# EAGLE schematic client (EAGLE 9.0.1)
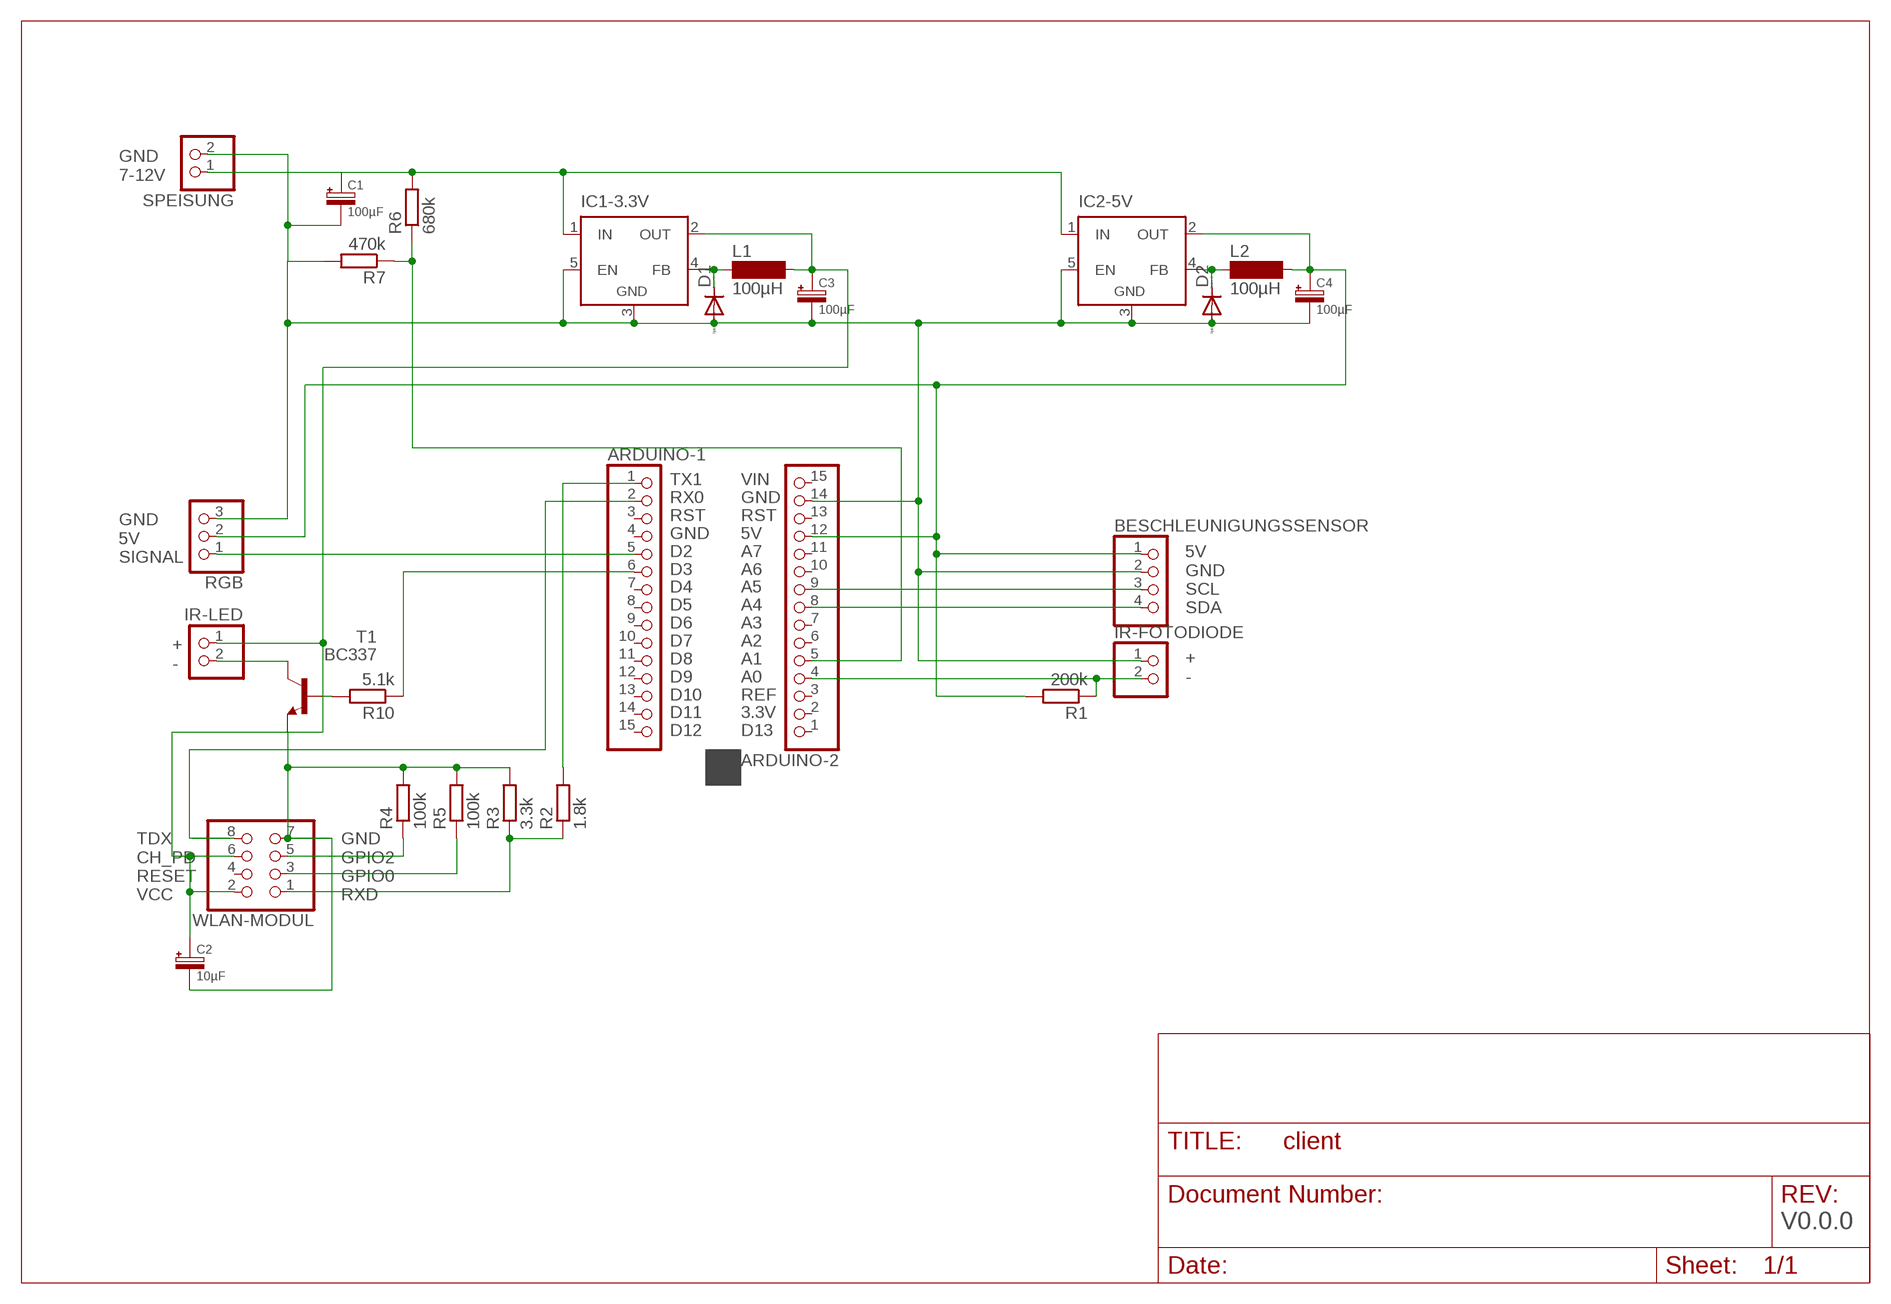
[diagram p0: schematic, sheet 1]

## Parts
ARDUINO-1  PINHD-1X15  [1X15]
ARDUINO-2  PINHD-1X15  [1X15]
BESCHLEUNIGUNGSSENSOR  PINHD-1X4  [1X04]
C1  100µF  KONDENSATOR_ELEKTROLYT  [KONDENSATOR_ELEKTROLYT]
C2  10µF  KONDENSATOR_ELEKTROLYT  [KONDENSATOR_ELEKTROLYT]
C3  100µF  KONDENSATOR_ELEKTROLYT  [KONDENSATOR_ELEKTROLYT]
C4  100µF  KONDENSATOR_ELEKTROLYT  [KONDENSATOR_ELEKTROLYT]
D1  DIODE-D-2.5  [D-2.5]
D2  DIODE-D-2.5  [D-2.5]
IC1-3.3V  LM2596TV  [TO220-51]
IC2-5V  LM2596TV  [TO220-51]
IR-FOTODIODE  PINHD-1X2  [1X02]
IR-LED  PINHD-1X2  [1X02]
L1  100µH  SM-L15A  [SM-L15A]
L2  100µH  SM-L15A  [SM-L15A]
R1  200k  R-EU_0204/2V  [0204V]
R2  1.8k  R-EU_0207/10  [0207/10]
R3  3.3k  R-EU_0207/10  [0207/10]
R4  100k  R-EU_0207/10  [0207/10]
R5  100k  R-EU_0207/10  [0207/10]
R6  680k  R-EU_0204/2V  [0204V]
R7  470k  R-EU_0204/2V  [0204V]
R10  5.1k  R-EU_0204/2V  [0204V]
RGB  PINHD-1X3  [1X03]
SPEISUNG  PINHD-1X2  [1X02]
T1  BC337  [TO92]
WLAN-MODUL  PINHD-2X4  [2X04]

## Nets
N$1: D1.C IC1-3.3V.4(FB) L1.1
N$3: C1.P$2 IC1-3.3V.1(IN) IC2-5V.1(IN) R6.2 SPEISUNG.1
N$4: ARDUINO-2.14 BESCHLEUNIGUNGSSENSOR.2 C1.P$1 C3.P$1 C4.P$1 D1.A D2.A IC1-3.3V.3(GND) IC1-3.3V.5(EN) IC2-5V.3(GND) IC2-5V.5(EN) IR-FOTODIODE.1 R7.2 RGB.3 SPEISUNG.2
N$5: D2.C IC2-5V.4(FB) L2.1
N$7: ARDUINO-2.5 R6.1 R7.1
N$8: C2.P$2 C3.P$2 IC1-3.3V.2(OUT) IR-LED.1 L1.2 WLAN-MODUL.2 WLAN-MODUL.6
N$10: C2.P$1 R3.2 R4.2 R5.2 T1.1(E) WLAN-MODUL.7
N$11: R2.1 R3.1 WLAN-MODUL.1
N$12: R5.1 WLAN-MODUL.3
N$13: R4.1 WLAN-MODUL.5
N$14: ARDUINO-1.1 R2.2
N$15: ARDUINO-1.2 WLAN-MODUL.8
N$16: IR-LED.2 T1.3(C)
N$17: ARDUINO-1.5 RGB.1
N$18: R10.2 T1.2(B)
N$19: ARDUINO-1.6 R10.1
N$20: ARDUINO-2.9 BESCHLEUNIGUNGSSENSOR.3
N$21: ARDUINO-2.8 BESCHLEUNIGUNGSSENSOR.4
N$22: ARDUINO-2.4 IR-FOTODIODE.2 R1.1
N$23: ARDUINO-2.12 BESCHLEUNIGUNGSSENSOR.1 C4.P$2 IC2-5V.2(OUT) L2.2 R1.2 RGB.2
Unconnected: ARDUINO-1.3 ARDUINO-1.4 ARDUINO-1.7 ARDUINO-1.8 ARDUINO-1.9 ARDUINO-1.10 ARDUINO-1.11 ARDUINO-1.12 ARDUINO-1.13 ARDUINO-1.14 ARDUINO-1.15 ARDUINO-2.1 ARDUINO-2.2 ARDUINO-2.3 ARDUINO-2.6 ARDUINO-2.7 ARDUINO-2.10 ARDUINO-2.11 ARDUINO-2.13 ARDUINO-2.15 WLAN-MODUL.4

## Notes on the sheet
- GND
  7-12V
- 5V
  GND
  SCL
  SDA
- GND 
  5V 
  SIGNAL
- +
  -
- +
  -
- TX1
  RX0
  RST
  GND
  D2
  D3
  D4
  D5
  D6
  D7
  D8
  D9
  D10
  D11
  D12
- VIN
  GND
  RST
  5V
  A7
  A6
  A5
  A4
  A3
  A2
  A1
  A0
  REF
  3.3V
  D13
- TDX
  CH_PD
  RESET
  VCC
- GND
  GPIO2
  GPIO0
  RXD
- V0.0.0

## Library data of the parts
ARDUINO-1 ARDUINO-2 = pinhead:PINHD-1X15: PIN HEADER
BESCHLEUNIGUNGSSENSOR = pinhead:PINHD-1X4: PIN HEADER
C1-C4 = 0_TEC-1.IPA Sven:KONDENSATOR_ELEKTROLYT
D1 D2 = diode:DIODE-: DIODE
IC1-3.3V IC2-5V = linear:LM2596T: STEP-DOWN VOLTAGE REGULATOR
IR-FOTODIODE IR-LED SPEISUNG = pinhead:PINHD-1X2: PIN HEADER
L1 L2 = inductor-neosid:SM-L15: INDUCTOR SMD air coil with pick and place cap; OC_FARNELL: unknown; OC_NEWARK: unknown
R1 R6 R7 = rcl:R-EU_: RESISTOR, European symbol; SPICEPREFIX: R
R2-R5 = rcl:R-EU_: RESISTOR, European symbol
R10 = resistor:R-EU_: RESISTOR, European symbol
RGB = pinhead:PINHD-1X3: PIN HEADER
T1 = transistor:BC337: NPN TRANSISTOR
WLAN-MODUL = pinhead:PINHD-2X4: PIN HEADER